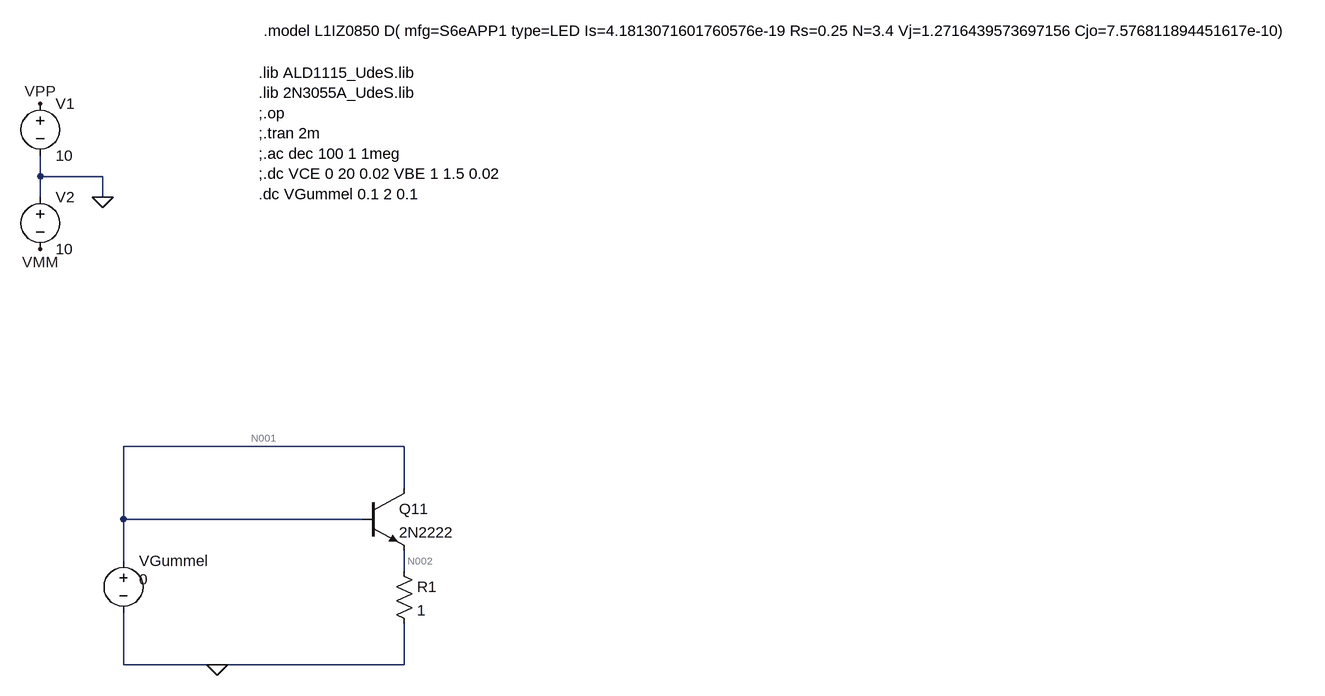
[diagram p0: schematic Gummeling.asc]
Gummeling.asc, the LTspice schematic file:
Version 4
SHEET 1 2260 1556
WIRE -976 64 -976 32
WIRE -880 64 -976 64
WIRE -976 96 -976 64
WIRE -880 96 -880 64
WIRE -416 480 -848 480
WIRE -416 544 -416 480
WIRE -848 592 -848 480
WIRE -480 592 -848 592
WIRE -848 656 -848 592
WIRE -416 672 -416 640
WIRE -848 816 -848 736
WIRE -704 816 -848 816
WIRE -416 816 -416 752
WIRE -416 816 -704 816
FLAG -976 -48 VPP
FLAG -976 176 VMM
FLAG -880 96 0
FLAG -704 816 0
SYMBOL /voltage -976 -64 R0
WINDOW 123 0 0 Left 0
WINDOW 39 0 0 Left 0
SYMATTR InstName V1
SYMATTR Value 10
SYMBOL /voltage -976 80 R0
WINDOW 123 0 0 Left 0
WINDOW 39 0 0 Left 0
SYMATTR InstName V2
SYMATTR Value 10
SYMBOL /npn -480 544 R0
SYMATTR InstName Q11
SYMATTR Value 2N2222
SYMBOL /voltage -848 640 R0
WINDOW 123 0 0 Left 0
WINDOW 39 0 0 Left 0
WINDOW 3 24 44 Left 2
SYMATTR Value 0
SYMATTR InstName VGummel
SYMBOL res -432 656 R0
SYMATTR InstName R1
SYMATTR Value 1
TEXT -640 -96 Left 2 !.lib ALD1115_UdeS.lib\n.lib 2N3055A_UdeS.lib\n;.op\n;.tran 2m\n;.ac dec 100 1 1meg\n;.dc VCE 0 20 0.02 VBE 1 1.5 0.02\n.dc VGummel 0.1 2 0.1
TEXT -632 -160 Left 2 !.model L1IZ0850 D( mfg=S6eAPP1 type=LED Is=4.1813071601760576e-19 Rs=0.25 N=3.4 Vj=1.2716439573697156 Cjo=7.576811894451617e-10)

The netlist it stands for:
* Gummeling.asc
V1 VPP 0 10
V2 0 VMM 10
Q11 N001 N001 N002 0 2N2222
VGummel N001 0 0
R1 N002 0 1
.model NPN NPN
.model PNP PNP
.lib standard.bjt
.lib ALD1115_UdeS.lib
.lib 2N3055A_UdeS.lib
;.op
;.tran 2m
;.ac dec 100 1 1meg
;.dc VCE 0 20 0.02 VBE 1 1.5 0.02
.dc VGummel 0.1 2 0.1
.model L1IZ0850 D( mfg=S6eAPP1 type=LED Is=4.1813071601760576e-19 Rs=0.25 N=3.4 Vj=1.2716439573697156 Cjo=7.576811894451617e-10)
.backanno
.end

* Results of the author's LTspice run, read from the files saved beside the schematic
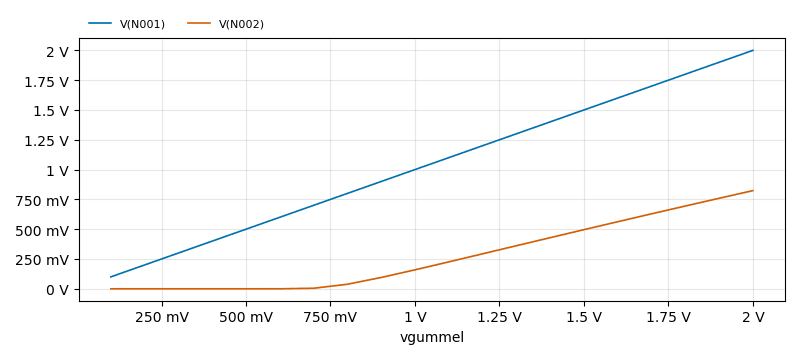
[diagram p1: DC transfer characteristic of Gummeling.asc, plotted from the saved traces]
* DC transfer characteristic, 1 run:
*   V(N001): 100 mV at vgummel=100 mV, 2 V at vgummel=2 V, min 100 mV, max 2 V
*   V(N002): 570 fV at vgummel=100 mV, 823.5 mV at vgummel=2 V, min 570 fV, max 823.5 mV